# Altium project RT_v1.4.PrjPcb
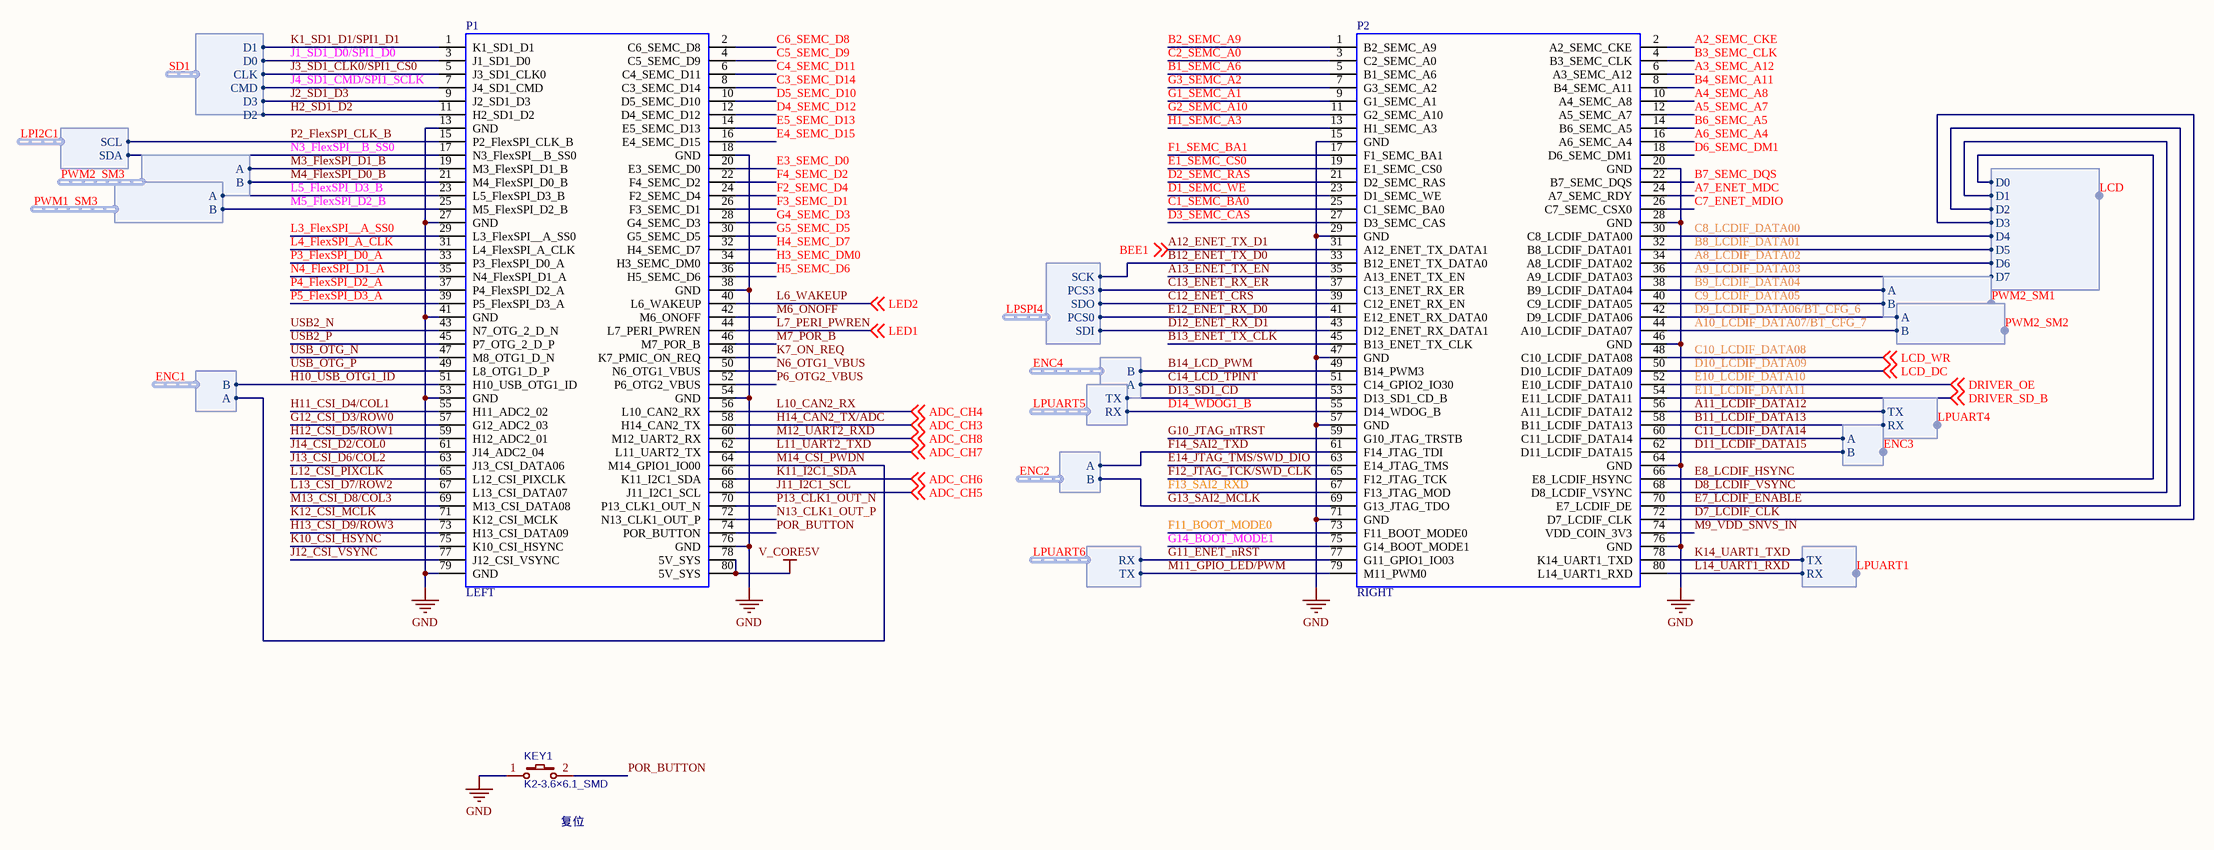
[diagram p0: COREv1.4.SchDoc]
6 sheets, 140 parts. Net scope: global (net labels, ports and power ports of the same name join across sheets).
Board file: RTv1.4.PcbDoc
Sheets:
  COREv1.4.SchDoc
  DCv1.4.SchDoc
  DRIVERv1.4.SchDoc
  CONNECTv1.4.SchDoc
  ANALOGv1.4.SchDoc
  CAMERAv1.4.SchDoc

## Sheet COREv1.4.SchDoc
size A2

### Parts
KEY1  K2-3.6×6.1_SMD  [KEY-SMD_2P-L6.2-W3.6-LS8.0]
P1  LEFT  [CON80]
P2  RIGHT  [CON80]

### Harnesses
I2C: SDA, SCL
data: D0, D1, D2, D3, D4, D5, D6, D7
PWM_SM: A, B
ENC: A, B
uart: TX, RX
SDHC: D1, D0, CLK, CMD, D3, D2
SPI: SDI, SDO, SCK, PCS0, PCS3

### Nets
GND: KEY1.1 P1.13(GND) P1.18(GND) P1.27(GND) P1.38(GND) P1.41(GND) P1.53(GND) P1.54(GND) P1.76(GND) P1.79(GND) P2.15(GND) P2.20(GND) P2.28(GND) P2.29(GND) P2.46(GND) P2.47(GND) P2.57(GND) P2.64(GND) P2.71(GND) P2.76(GND)
V_CORE5V: P1.78(5V_SYS) P1.80(5V_SYS)
A2_SEMC_CKE: P2.2(A2_SEMC_CKE)
A3_SEMC_A12: P2.6(A3_SEMC_A12)
A4_SEMC_A8: P2.10(A4_SEMC_A8)
A5_SEMC_A7: P2.12(A5_SEMC_A7)
A6_SEMC_A4: P2.16(A6_SEMC_A4)
A7_ENET_MDC: P2.24(A7_SEMC_RDY)
A8_LCDIF_DATA02: P2.34(A8_LCDIF_DATA02) ; harness data.D6
A9_LCDIF_DATA03: P2.36(A9_LCDIF_DATA03) ; harness data.D7
A10_LCDIF_DATA07/BT_CFG_7: P2.44(A10_LCDIF_DATA07) ; harness PWM_SM.B
A11_LCDIF_DATA12: P2.56(A11_LCDIF_DATA12) ; harness uart.TX
A12_ENET_TX_D1: P2.31(A12_ENET_TX_DATA1) ; off-sheet BEE1  [also labelled BEE1]
A13_ENET_TX_EN: P2.35(A13_ENET_TX_EN)
B1_SEMC_A6: P2.5(B1_SEMC_A6)
B2_SEMC_A9: P2.1(B2_SEMC_A9)
B3_SEMC_CLK: P2.4(B3_SEMC_CLK)
B4_SEMC_A11: P2.8(B4_SEMC_A11)
B6_SEMC_A5: P2.14(B6_SEMC_A5)
B7_SEMC_DQS: P2.22(B7_SEMC_DQS)
B8_LCDIF_DATA01: P2.32(B8_LCDIF_DATA01) ; harness data.D5
B9_LCDIF_DATA04: P2.38(B9_LCDIF_DATA04) ; harness PWM_SM.A
B11_LCDIF_DATA13: P2.58(B11_LCDIF_DATA13) ; harness uart.RX
B12_ENET_TX_D0: P2.33(B12_ENET_TX_DATA0) ; harness SPI.SCK
B13_ENET_TX_CLK: P2.45(B13_ENET_TX_CLK)
B14_LCD_PWM: P2.49(B14_PWM3) ; harness ENC.B
C1_SEMC_BA0: P2.25(C1_SEMC_BA0)
C2_SEMC_A0: P2.3(C2_SEMC_A0)
C3_SEMC_D14: P1.8(C3_SEMC_D14)
C4_SEMC_D11: P1.6(C4_SEMC_D11)
C5_SEMC_D9: P1.4(C5_SEMC_D9)
C6_SEMC_D8: P1.2(C6_SEMC_D8)
C7_ENET_MDIO: P2.26(C7_SEMC_CSX0)
C8_LCDIF_DATA00: P2.30(C8_LCDIF_DATA00) ; harness data.D4
C9_LCDIF_DATA05: P2.40(C9_LCDIF_DATA05) ; harness PWM_SM.B
C10_LCDIF_DATA08: P2.48(C10_LCDIF_DATA08) ; off-sheet LCD_WR  [also labelled LCD_WR]
C11_LCDIF_DATA14: P2.60(C11_LCDIF_DATA14) ; harness ENC.A
C12_ENET_CRS: P2.39(C12_ENET_RX_EN) ; harness SPI.SDO
C13_ENET_RX_ER: P2.37(C13_ENET_RX_ER) ; harness SPI.PCS3
C14_LCD_TPINT: P2.51(C14_GPIO2_IO30) ; harness ENC.A
D1_SEMC_WE: P2.23(D1_SEMC_WE)
D2_SEMC_RAS: P2.21(D2_SEMC_RAS)
D3_SEMC_CAS: P2.27(D3_SEMC_CAS)
D4_SEMC_D12: P1.12(D4_SEMC_D12)
D5_SEMC_D10: P1.10(D5_SEMC_D10)
D6_SEMC_DM1: P2.18(D6_SEMC_DM1)
D7_LCDIF_CLK: P2.72(D7_LCDIF_CLK) ; harness data.D3
D8_LCDIF_VSYNC: P2.68(D8_LCDIF_VSYNC) ; harness data.D1
D9_LCDIF_DATA06/BT_CFG_6: P2.42(D9_LCDIF_DATA06) ; harness PWM_SM.A
D10_LCDIF_DATA09: P2.50(D10_LCDIF_DATA09) ; off-sheet LCD_DC  [also labelled LCD_DC]
D11_LCDIF_DATA15: P2.62(D11_LCDIF_DATA15) ; harness ENC.B
D12_ENET_RX_D1: P2.43(D12_ENET_RX_DATA1) ; harness SPI.SDI
D13_SD1_CD: P2.53(D13_SD1_CD_B) ; harness uart.TX
D14_WDOG1_B: P2.55(D14_WDOG_B) ; harness uart.RX
E1_SEMC_CS0: P2.19(E1_SEMC_CS0)
E3_SEMC_D0: P1.20(E3_SEMC_D0)
E4_SEMC_D15: P1.16(E4_SEMC_D15)
E5_SEMC_D13: P1.14(E5_SEMC_D13)
E7_LCDIF_ENABLE: P2.70(E7_LCDIF_DE) ; harness data.D2
E8_LCDIF_HSYNC: P2.66(E8_LCDIF_HSYNC) ; harness data.D0
E10_LCDIF_DATA10: P2.52(E10_LCDIF_DATA10) ; off-sheet DRIVER_OE  [also labelled DRIVER_OE]
E11_LCDIF_DATA11: P2.54(E11_LCDIF_DATA11) ; off-sheet DRIVER_SD_B  [also labelled DRIVER_SD_B]
E12_ENET_RX_D0: P2.41(E12_ENET_RX_DATA0) ; harness SPI.PCS0
E14_JTAG_TMS/SWD_DIO: P2.63(E14_JTAG_TMS)
F1_SEMC_BA1: P2.17(F1_SEMC_BA1)
F2_SEMC_D4: P1.24(F2_SEMC_D4)
F3_SEMC_D1: P1.26(F3_SEMC_D1)
F4_SEMC_D2: P1.22(F4_SEMC_D2)
F11_BOOT_MODE0: P2.73(F11_BOOT_MODE0)
F12_JTAG_TCK/SWD_CLK: P2.65(F12_JTAG_TCK)
F13_SAI2_RXD: P2.67(F13_JTAG_MOD)
F14_SAI2_TXD: P2.61(F14_JTAG_TDI) ; harness ENC.A  [project net ENC2.A]
G1_SEMC_A1: P2.9(G1_SEMC_A1)
G2_SEMC_A10: P2.11(G2_SEMC_A10)
G3_SEMC_A2: P2.7(G3_SEMC_A2)
G4_SEMC_D3: P1.28(G4_SEMC_D3)
G5_SEMC_D5: P1.30(G5_SEMC_D5)
G10_JTAG_nTRST: P2.59(G10_JTAG_TRSTB)
G11_ENET_nRST: P2.77(G11_GPIO1_IO03) ; harness uart.RX
G12_CSI_D3/ROW0: P1.57(G12_ADC2_03)
G13_SAI2_MCLK: P2.69(G13_JTAG_TDO) ; harness ENC.B  [project net ENC2.B]
G14_BOOT_MODE1: P2.75(G14_BOOT_MODE1)
H1_SEMC_A3: P2.13(H1_SEMC_A3)
H2_SD1_D2: P1.11(H2_SD1_D2) ; harness SDHC.D2
H3_SEMC_DM0: P1.34(H3_SEMC_DM0)
H4_SEMC_D7: P1.32(H4_SEMC_D7)
H5_SEMC_D6: P1.36(H5_SEMC_D6)
H10_USB_OTG1_ID: P1.51(H10_USB_OTG1_ID) ; harness ENC.B  [project net ENC1.B]
H11_CSI_D4/COL1: P1.55(H11_ADC2_02)
H12_CSI_D5/ROW1: P1.59(H12_ADC2_01)
H13_CSI_D9/ROW3: P1.73(H13_CSI_DATA09)
H14_CAN2_TX/ADC: P1.58(H14_CAN2_TX) ; off-sheet ADC_CH3  [also labelled ADC_CH3]
J1_SD1_D0/SPI1_D0: P1.3(J1_SD1_D0) ; harness SDHC.D0
J2_SD1_D3: P1.9(J2_SD1_D3) ; harness SDHC.D3
J3_SD1_CLK0/SPI1_CS0: P1.5(J3_SD1_CLK0) ; harness SDHC.CLK
J4_SD1_CMD/SPI1_SCLK: P1.7(J4_SD1_CMD) ; harness SDHC.CMD
J11_I2C1_SCL: P1.68(J11_I2C1_SCL) ; off-sheet ADC_CH5  [also labelled ADC_CH5]
J12_CSI_VSYNC: P1.77(J12_CSI_VSYNC)
J13_CSI_D6/COL2: P1.63(J13_CSI_DATA06)
J14_CSI_D2/COL0: P1.61(J14_ADC2_04)
K1_SD1_D1/SPI1_D1: P1.1(K1_SD1_D1) ; harness SDHC.D1
K7_ON_REQ: P1.48(K7_PMIC_ON_REQ)
K10_CSI_HSYNC: P1.75(K10_CSI_HSYNC)
K11_I2C1_SDA: P1.66(K11_I2C1_SDA) ; off-sheet ADC_CH6  [also labelled ADC_CH6]
K12_CSI_MCLK: P1.71(K12_CSI_MCLK)
K14_UART1_TXD: P2.78(K14_UART1_TXD) ; harness uart.TX
L3_FlexSPI__A_SS0: P1.29(L3_FlexSPI__A_SS0)
L4_FlexSPI_A_CLK: P1.31(L4_FlexSPI_A_CLK)
L5_FlexSPI_D3_B: P1.23(L5_FlexSPI_D3_B) ; harness PWM_SM.A
L6_WAKEUP: P1.40(L6_WAKEUP) ; off-sheet LED2  [also labelled LED2]
L7_PERI_PWREN: P1.44(L7_PERI_PWREN) ; off-sheet LED1  [also labelled LED1]
L10_CAN2_RX: P1.56(L10_CAN2_RX) ; off-sheet ADC_CH4  [also labelled ADC_CH4]
L11_UART2_TXD: P1.62(L11_UART2_TX) ; off-sheet ADC_CH7  [also labelled ADC_CH7]
L12_CSI_PIXCLK: P1.65(L12_CSI_PIXCLK)
L13_CSI_D7/ROW2: P1.67(L13_CSI_DATA07)
L14_UART1_RXD: P2.80(L14_UART1_RXD) ; harness uart.RX
M3_FlexSPI_D1_B: P1.19(M3_FlexSPI_D1_B) ; harness PWM_SM.A
M4_FlexSPI_D0_B: P1.21(M4_FlexSPI_D0_B) ; harness PWM_SM.B
M5_FlexSPI_D2_B: P1.25(M5_FlexSPI_D2_B) ; harness PWM_SM.B
M6_ONOFF: P1.42(M6_ONOFF)
M7_POR_B: P1.46(M7_POR_B)
M9_VDD_SNVS_IN: P2.74(VDD_COIN_3V3)
M11_GPIO_LED/PWM: P2.79(M11_PWM0) ; harness uart.TX  [project net LPUART6.TX]
M12_UART2_RXD: P1.60(M12_UART2_RX) ; off-sheet ADC_CH8  [also labelled ADC_CH8]
M13_CSI_D8/COL3: P1.69(M13_CSI_DATA08)
M14_CSI_PWDN: P1.64(M14_GPIO1_IO00) ; harness ENC.A  [project net ENC1.A]
N3_FlexSPI__B_SS0: P1.17(N3_FlexSPI__B_SS0) ; harness I2C.SDA  [project net LPI2C1.SDA]
N4_FlexSPI_D1_A: P1.35(N4_FlexSPI_D1_A)
N6_OTG1_VBUS: P1.50(N6_OTG1_VBUS)
N13_CLK1_OUT_P: P1.72(N13_CLK1_OUT_P)
P2_FlexSPI_CLK_B: P1.15(P2_FlexSPI_CLK_B) ; harness I2C.SCL  [project net LPI2C1.SCL]
P3_FlexSPI_D0_A: P1.33(P3_FlexSPI_D0_A)
P4_FlexSPI_D2_A: P1.37(P4_FlexSPI_D2_A)
P5_FlexSPI_D3_A: P1.39(P5_FlexSPI_D3_A)
P6_OTG2_VBUS: P1.52(P6_OTG2_VBUS)
P13_CLK1_OUT_N: P1.70(P13_CLK1_OUT_N)
POR_BUTTON: KEY1.2 P1.74(POR_BUTTON)
USB2_N: P1.43(N7_OTG_2_D_N)
USB2_P: P1.45(P7_OTG_2_D_P)
USB_OTG_N: P1.47(M8_OTG1_D_N)
USB_OTG_P: P1.49(L8_OTG1_D_P)

### Notes on the sheet
- (near KEY1) 复位

### Library data of the parts
KEY1 = K2-3.6×6.1_SMD: BOM_Manufacturer Part: K2-1107ST-A4SW-06; Contributor: LCEDA_Lib; 制造商: 韩国韩荣; BOM_Supplier Part: C118141; BOM_Supplier: LCSC; spicePre: K; spiceSymbolName: K2-3.6×6.1_SMD
P1 = Header40X2_left: Header, 30-Pin, Dual row; LatestRevisionDate: 17-Jul-2002; LatestRevisionNote: Re-released for DXP Platform.; Publisher: Altium Limited
P2 = Header40X2_right: Header, 30-Pin, Dual row; LatestRevisionDate: 17-Jul-2002; LatestRevisionNote: Re-released for DXP Platform.; Publisher: Altium Limited

## Sheet DCv1.4.SchDoc
size A4
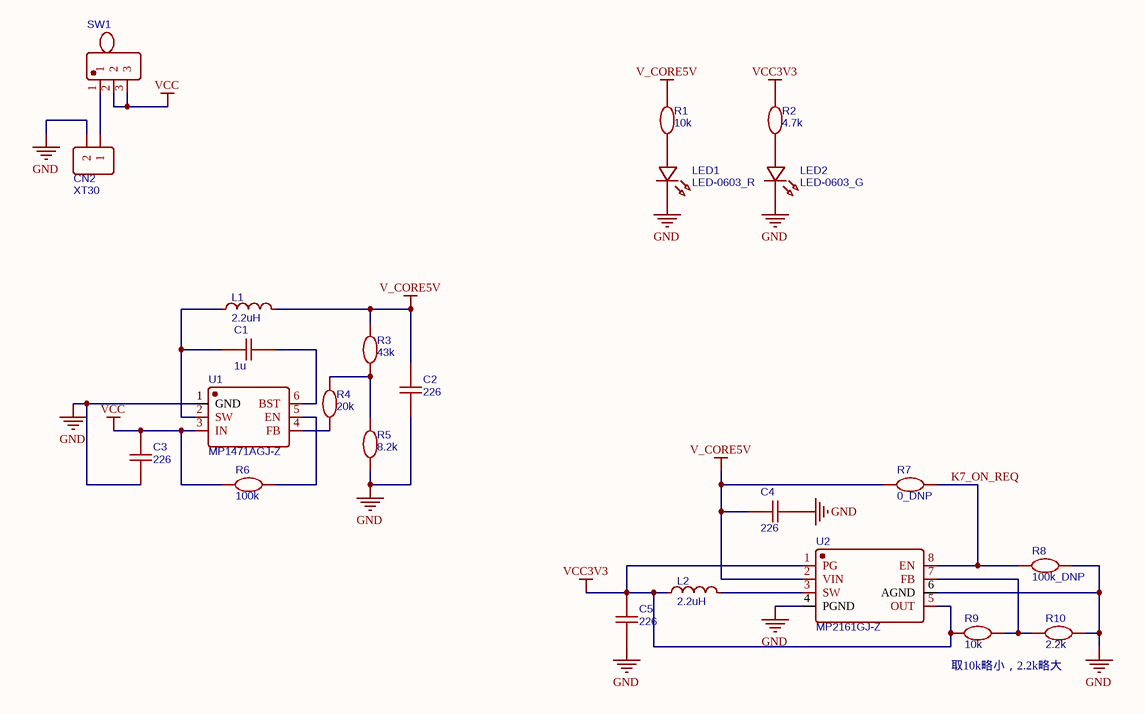
[diagram p1: DCv1.4.SchDoc]

### Parts
C1  1u  [C0603]
C2  226  [C0603]
C3  226  [C0603]
C4  226  [C0603]
C5  226  [C0603]
CN2  XT30  [CONN-TH_XT30UPB-F]
L1  2.2uH  [IND-SMD_L4.4-W4.2]
L2  2.2uH  [IND-SMD_L4.4-W4.2]
LED1  LED-0603_R  [LED0603_RED]
LED2  LED-0603_G  [LED0603_GREEN]
R1  10k  [R0603]
R2  4.7k  [R0603]
R3  43k  [R0603]
R4  20k  [R0603]
R5  8.2k  [R0603]
R6  100k  [R0603]
R7  0_DNP  [R0603]
R8  100k_DNP  [R0603]
R9  10k  [R0603]
R10  2.2k  [R0603]
SW1  2MS1T1B1M1QES-5  [SW-TH_2MD1T1B1M1QES-5]  (value not drawn)
U1  MP1471AGJ-Z  [TSOT-23-6_L2.9-W1.6-P0.95-LS2.8-BR]
U2  MP2161GJ-Z  [TSOT-23-8_L2.9-W1.6-P0.65-LS2.8-BR]

### Nets
GND: C2.1 C3.1 C4.1 C5.1 CN2.2 LED1.2 LED2.2 R5.1 R8.2 R10.2 U1.1(GND) U2.4(PGND) U2.6(AGND)
V_CORE5V: C2.2 C4.2 L1.2 R1.2 R3.2 R7.1 U2.2(VIN)
VCC: C3.2 R6.2 SW1.2 SW1.3 U1.3(IN)
VCC3V3: C5.2 L2.1 R2.2 R9.1 U2.1(PG) U2.5(OUT)
K7_ON_REQ: R7.2 R8.1 U2.8(EN)
NetC1_1: C1.1 L1.1 U1.2(SW)
NetC1_2: C1.2 U1.6(BST)
NetCN2_1: CN2.1 SW1.1
NetL2_2: L2.2 U2.3(SW)
NetLED1_1: LED1.1 R1.1
NetLED2_1: LED2.1 R2.1
NetR3_1: R3.1 R4.2 R5.2
NetR4_1: R4.1 U1.4(FB)
NetR6_1: R6.1 U1.5(EN)
NetR9_2: R9.2 R10.1 U2.7(FB)

### Notes on the sheet
- 取10k略小，2.2k略大

### Library data of the parts
C1-C5 = C0603: nameAlias: Value(F); Contributor: LCEDA_Lib; spicePre: C; spiceSymbolName: C_0603_US
CN2 = XT30: BOM_Manufacturer: Changzhou Amass Elec; BOM_Manufacturer Part: XT30UPB-F; nameAlias: Value; Contributor: LCSC; BOM_Supplier: LCSC; BOM_Supplier Part: C108769; spicePre: C; spiceSymbolName: XT30UPB-F
L1 L2 = L0420: BOM_Manufacturer: Changjiang Microelectronics Tech; BOM_Manufacturer Part: FXL0420-2R2-M; nameAlias: Inductance; Contributor: LCSC; BOM_Supplier: LCSC; BOM_Supplier Part: C167206; spicePre: L; spiceSymbolName: FXL0420-2R2-M
LED1 = LED-0603_R: BOM_Manufacturer: EVERLIGHT(台湾亿光); BOM_Manufacturer Part: 19-217/R6C-AL1M2VY/3T; Contributor: LCEDA_01; BOM_Supplier Part: C72044; BOM_Supplier: LCSC; spicePre: L; spiceSymbolName: LED-0603_R
LED2 = LED-0603_G: BOM_Manufacturer: EVERLIGHT(台湾亿光); BOM_Manufacturer Part: 19-217/GHC-YR1S2/3T; Contributor: LCEDA_Lib; BOM_Supplier Part: C72043; BOM_Supplier: LCSC; spicePre: L; spiceSymbolName: LED-0603_G
R1-R10 = R0603: nameAlias: Value(Ω); Contributor: LCEDA_Lib; spicePre: R; spiceSymbolName: R_0603_EU
SW1 = 2MS1T1B1M1QES-5: BOM_Manufacturer: Dailywell; Contributor: LCSC; BOM_Supplier: LCSC; BOM_Supplier Part: C496169; BOM_Manufacturer Part: 2MS1T1B1M1QES-5; spicePre: S; spiceSymbolName: 2MS1T1B1M1QES-5
U1 = MP1471AGJ-Z: BOM_Manufacturer: MPS; SMT Type: Extend; BOM_Supplier: LCSC; BOM_Manufacturer Part: MP1471AGJ-Z; image: //image.lceda.cn/szlcsc/C58565.jpg; BOM_Supplier Part: C58565; BOM_LCSC Assembly: Yes; spicePre: U; spiceSymbolName: MP1471AGJ-Z
U2 = MP2161GJ-Z: BOM_Manufacturer: MPS; SMT Type: Extend; BOM_Supplier: LCSC; BOM_Manufacturer Part: MP2161GJ-Z; image: //image.lceda.cn/szlcsc/C84831.jpg; BOM_Supplier Part: C84831; BOM_LCSC Assembly: Yes; spicePre: U; spiceSymbolName: MP2161GJ-Z

## Sheet DRIVERv1.4.SchDoc
size A4
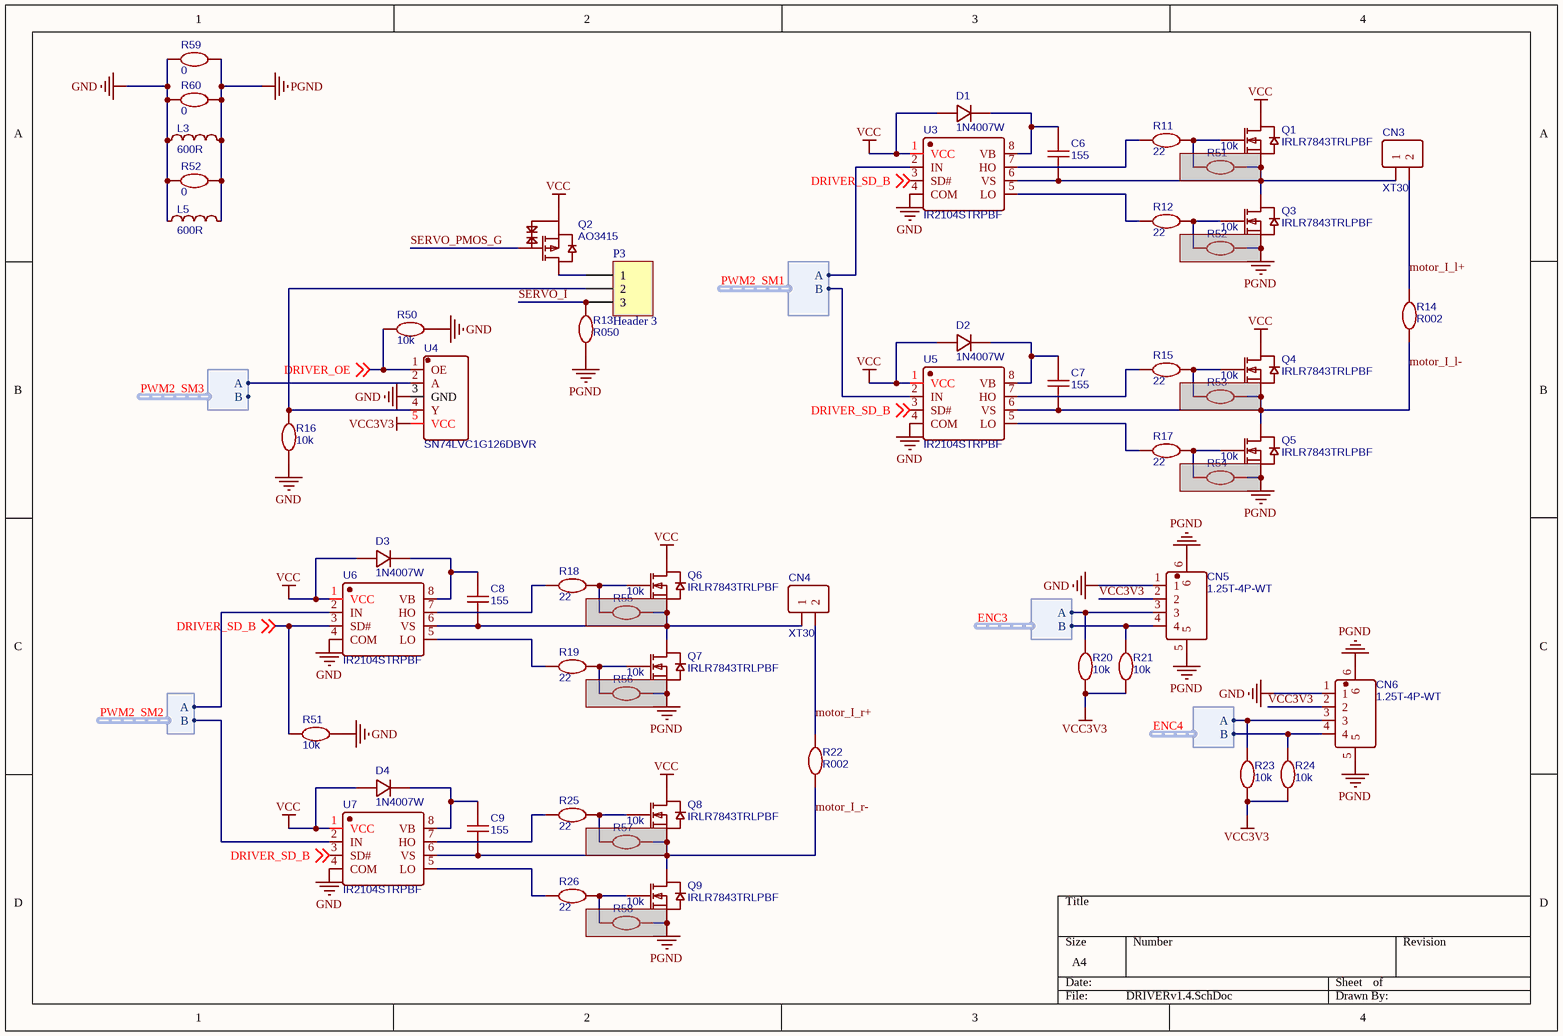
[diagram p2: DRIVERv1.4.SchDoc]

### Parts
(Parts that share a designator on the sheet are numbered #1, #2 ... from top to bottom, then left to right.)
C6  155  [C0603]
C7  155  [C0603]
C8  155  [C0603]
C9  155  [C0603]
CN3  XT30  [CONN-TH_XT30UPB-F]
CN4  XT30  [CONN-TH_XT30UPB-F]
CN5  1.25T-4P-WT  [CONN-SMD_4P-1.25P_1.25T-4P]
CN6  1.25T-4P-WT  [CONN-SMD_4P-1.25P_1.25T-4P]
D1  1N4007W  [SOD-123_L2.8-W1.8-LS3.7-RD]
D2  1N4007W  [SOD-123_L2.8-W1.8-LS3.7-RD]
D3  1N4007W  [SOD-123_L2.8-W1.8-LS3.7-RD]
D4  1N4007W  [SOD-123_L2.8-W1.8-LS3.7-RD]
L3  600R  [L0603]
L5  600R  [L0603]
P3  Header 3  [HDR1X3]
Q1  IRLR7843TRLPBF  [DPAK_L6.5-W6.0-P2.29-LS9.9-TL]
Q2  AO3415  [SOT-23-3_L2.9-W1.3-P1.90-LS2.4-BR]
Q3  IRLR7843TRLPBF  [DPAK_L6.5-W6.0-P2.29-LS9.9-TL]
Q4  IRLR7843TRLPBF  [DPAK_L6.5-W6.0-P2.29-LS9.9-TL]
Q5  IRLR7843TRLPBF  [DPAK_L6.5-W6.0-P2.29-LS9.9-TL]
Q6  IRLR7843TRLPBF  [DPAK_L6.5-W6.0-P2.29-LS9.9-TL]
Q7  IRLR7843TRLPBF  [DPAK_L6.5-W6.0-P2.29-LS9.9-TL]
Q8  IRLR7843TRLPBF  [DPAK_L6.5-W6.0-P2.29-LS9.9-TL]
Q9  IRLR7843TRLPBF  [DPAK_L6.5-W6.0-P2.29-LS9.9-TL]
R11  22  [R0603]
R12  22  [R0603]
R13  R050  [R2010]
R14  R002  [R2010]
R15  22  [R0603]
R16  10k  [R0603]
R17  22  [R0603]
R18  22  [R0603]
R19  22  [R0603]
R20  10k  [R0603]
R21  10k  [R0603]
R22  R002  [R2010]
R23  10k  [R0603]
R24  10k  [R0603]
R25  22  [R0603]
R26  22  [R0603]
R50#1  10k  [R0603]
R51#1  10k  [R0603]  (masked out: inside a compile mask, not in the netlist)
R51#2  10k  [R0603]
R52#1  0  [R0603]
R52#2  10k  [R0603]  (masked out: inside a compile mask, not in the netlist)
R53  10k  [R0603]  (masked out: inside a compile mask, not in the netlist)
R54  10k  [R0603]  (masked out: inside a compile mask, not in the netlist)
R55  10k  [R0603]  (masked out: inside a compile mask, not in the netlist)
R56  10k  [R0603]  (masked out: inside a compile mask, not in the netlist)
R57  10k  [R0603]  (masked out: inside a compile mask, not in the netlist)
R58  10k  [R0603]  (masked out: inside a compile mask, not in the netlist)
R59  0  [R0603]
R60  0  [R0603]
U3  IR2104STRPBF  [SOIC-8_L4.9-W3.9-P1.27-LS6.0-BL]
U4  SN74LVC1G126DBVR  [SOT-23-5_L3.0-W1.7-P0.95-LS2.8-BR]
U5  IR2104STRPBF  [SOIC-8_L4.9-W3.9-P1.27-LS6.0-BL]
U6  IR2104STRPBF  [SOIC-8_L4.9-W3.9-P1.27-LS6.0-BL]
U7  IR2104STRPBF  [SOIC-8_L4.9-W3.9-P1.27-LS6.0-BL]

### Harnesses
ENC: A, B
PWM_SM: A, B

### Nets
GND: CN5.1 CN6.1 L3.1 L5.1 R16.1 R50#1.1 R51#2.1 R52#1.1 R59.1 R60.1 U3.4(COM) U4.3(GND) U5.4(COM) U6.4(COM) U7.4(COM)
PGND: CN5.5 CN5.6 CN6.5 CN6.6 L3.2 L5.2 R13.1 R52#1.2 R59.2 R60.2
VCC: D1.2 D2.2 D3.2 D4.2 Q1.4(D) Q2.2(S) Q4.4(D) Q6.4(D) Q8.4(D) U3.1(VCC) U5.1(VCC) U6.1(VCC) U7.1(VCC)
VCC3V3: CN5.2 CN6.2 R20.1 R21.1 R23.1 R24.1 U4.5(VCC)
A10_LCDIF_DATA07/BT_CFG_7: U7.2(IN) ; harness PWM_SM.B
B9_LCDIF_DATA04: U3.2(IN) ; harness PWM_SM.A
B14_LCD_PWM: CN6.4 R24.2 ; harness ENC.B
C9_LCDIF_DATA05: U5.2(IN) ; harness PWM_SM.B
C11_LCDIF_DATA14: CN5.3 R20.2 ; harness ENC.A
C14_LCD_TPINT: CN6.3 R23.2 ; harness ENC.A
D9_LCDIF_DATA06/BT_CFG_6: U6.2(IN) ; harness PWM_SM.A
D11_LCDIF_DATA15: CN5.4 R21.2 ; harness ENC.B
DRIVER_OE: R50#1.2 U4.1(OE) ; off-sheet DRIVER_OE  [project net E10_LCDIF_DATA10]
DRIVER_SD_B: R51#2.2 U3.3(SD#) U5.3(SD#) U6.3(SD#) U7.3(SD#) ; off-sheet DRIVER_SD_B  [project net E11_LCDIF_DATA11]
M3_FlexSPI_D1_B: U4.2(A) ; harness PWM_SM.A
motor_I_l+: CN3.2 R14.2
motor_I_l-: C7.1 Q4.3(S) Q5.4(D) R14.1 U5.6(VS)
motor_I_r+: CN4.2 R22.2
motor_I_r-: C9.1 Q8.3(S) Q9.4(D) R22.1 U7.6(VS)
SERVO_I: P3.3 R13.2
SERVO_PMOS_G: Q2.1(G)
NetC6_1: C6.1 CN3.1 Q1.3(S) Q3.4(D) U3.6(VS)
NetC6_2: C6.2 D1.1 U3.8(VB)
NetC7_2: C7.2 D2.1 U5.8(VB)
NetC8_1: C8.1 CN4.1 Q6.3(S) Q7.4(D) U6.6(VS)
NetC8_2: C8.2 D3.1 U6.8(VB)
NetC9_2: C9.2 D4.1 U7.8(VB)
NetP3_1: P3.1 Q2.3(D)
NetP3_2: P3.2 R16.2 U4.4(Y)
NetQ1_1: Q1.1(G) R11.2
NetQ3_1: Q3.1(G) R12.2
NetQ4_1: Q4.1(G) R15.2
NetQ5_1: Q5.1(G) R17.2
NetQ6_1: Q6.1(G) R18.2
NetQ7_1: Q7.1(G) R19.2
NetQ8_1: Q8.1(G) R25.2
NetQ9_1: Q9.1(G) R26.2
NetR11_1: R11.1 U3.7(HO)
NetR12_1: R12.1 U3.5(LO)
NetR15_1: R15.1 U5.7(HO)
NetR17_1: R17.1 U5.5(LO)
NetR18_1: R18.1 U6.7(HO)
NetR19_1: R19.1 U6.5(LO)
NetR25_1: R25.1 U7.7(HO)
NetR26_1: R26.1 U7.5(LO)

Not connected (* = marked no-connect by the designer): Q3 3(S); Q5 3(S); Q7 3(S); Q9 3(S)

### Library data of the parts
C6-C9 = C0603: as C1 on sheet DCv1.4; spicePre: C; spiceSymbolName: C_0603_US
CN3 CN4 = XT30: as CN2 on sheet DCv1.4; BOM_Supplier: LCSC; BOM_Supplier Part: C108769; spicePre: C; spiceSymbolName: XT30UPB-F
CN5 CN6 = 1.25T-4P-WT: BOM_Manufacturer: HRO; Contributor: LCSC; BOM_Supplier: LCSC; BOM_Manufacturer Part: 1.25T-4P-WT; BOM_Supplier Part: C125739; spicePre: C; spiceSymbolName: 1.25T-4P-WT
D1-D4 = 1N4007W: BOM_Manufacturer: BLUE ROCKET; Contributor: LCEDA_Lib; BOM_Supplier: LCSC; BOM_Supplier Part: C328592; BOM_Manufacturer Part: 1N4007W; spicePre: D; spiceSymbolName: 1N4007W
L3 L5 = L0603: nameAlias: Value(H); Contributor: LCEDA_Lib; spicePre: L; spiceSymbolName: L0603_US
P3 = Header 3: Header, 3-Pin; LatestRevisionDate: 17-Jul-2002; LatestRevisionNote: Re-released for DXP Platform.; Publisher: Altium Limited
Q1 Q3-Q9 = IRLR7843TRLPBF: BOM_Manufacturer: Infineon Technologies; Contributor: LCSC; BOM_Supplier: LCSC; BOM_Supplier Part: C538178; BOM_Manufacturer Part: IRLR7843TRLPBF; spicePre: Q; spiceSymbolName: IRLR7843TRLPBF
Q2 = AO3415: BOM_Manufacturer: AOS; SMT Type: Extend; BOM_Supplier: LCSC; BOM_Manufacturer Part: AO3415; image: //image.lceda.cn/szlcsc/C14354.jpg; BOM_Supplier Part: C14354; BOM_LCSC Assembly: Yes; spicePre: Q; spiceSymbolName: AO3415
R11 R12 R15-R21 R23-R26 R50#1 R51#1 R51#2 R52#1 R52#2 R53-R60 = R0603: as R1 on sheet DCv1.4; spicePre: R; spiceSymbolName: R_0603_EU
R13 R14 R22 = R2010: nameAlias: Value(Ω); Contributor: LCEDA_Lib; spicePre: R; spiceSymbolName: R_2010_EU
U3 U5-U7 = IR2104STRPBF: BOM_Manufacturer: IR; SMT Type: Extend; spicePre: X; BOM_Supplier: LCSC; BOM_Manufacturer Part: IR2104STRPBF; image: //image.lceda.cn/szlcsc/C2960.jpg; BOM_Supplier Part: C2960; BOM_LCSC Assembly: Yes; spiceSymbolName: IR2104STRPBF
U4 = SN74LVC1G126DBVR: BOM_Manufacturer: TI; SMT Type: Extend; BOM_Supplier: LCSC; BOM_Manufacturer Part: SN74LVC1G126DBVR; image: //image.lceda.cn/szlcsc/C7834.jpg; BOM_Supplier Part: C7834; BOM_LCSC Assembly: Yes; spicePre: U; spiceSymbolName: SN74LVC1G126DBVR

## Sheet CONNECTv1.4.SchDoc
size A3
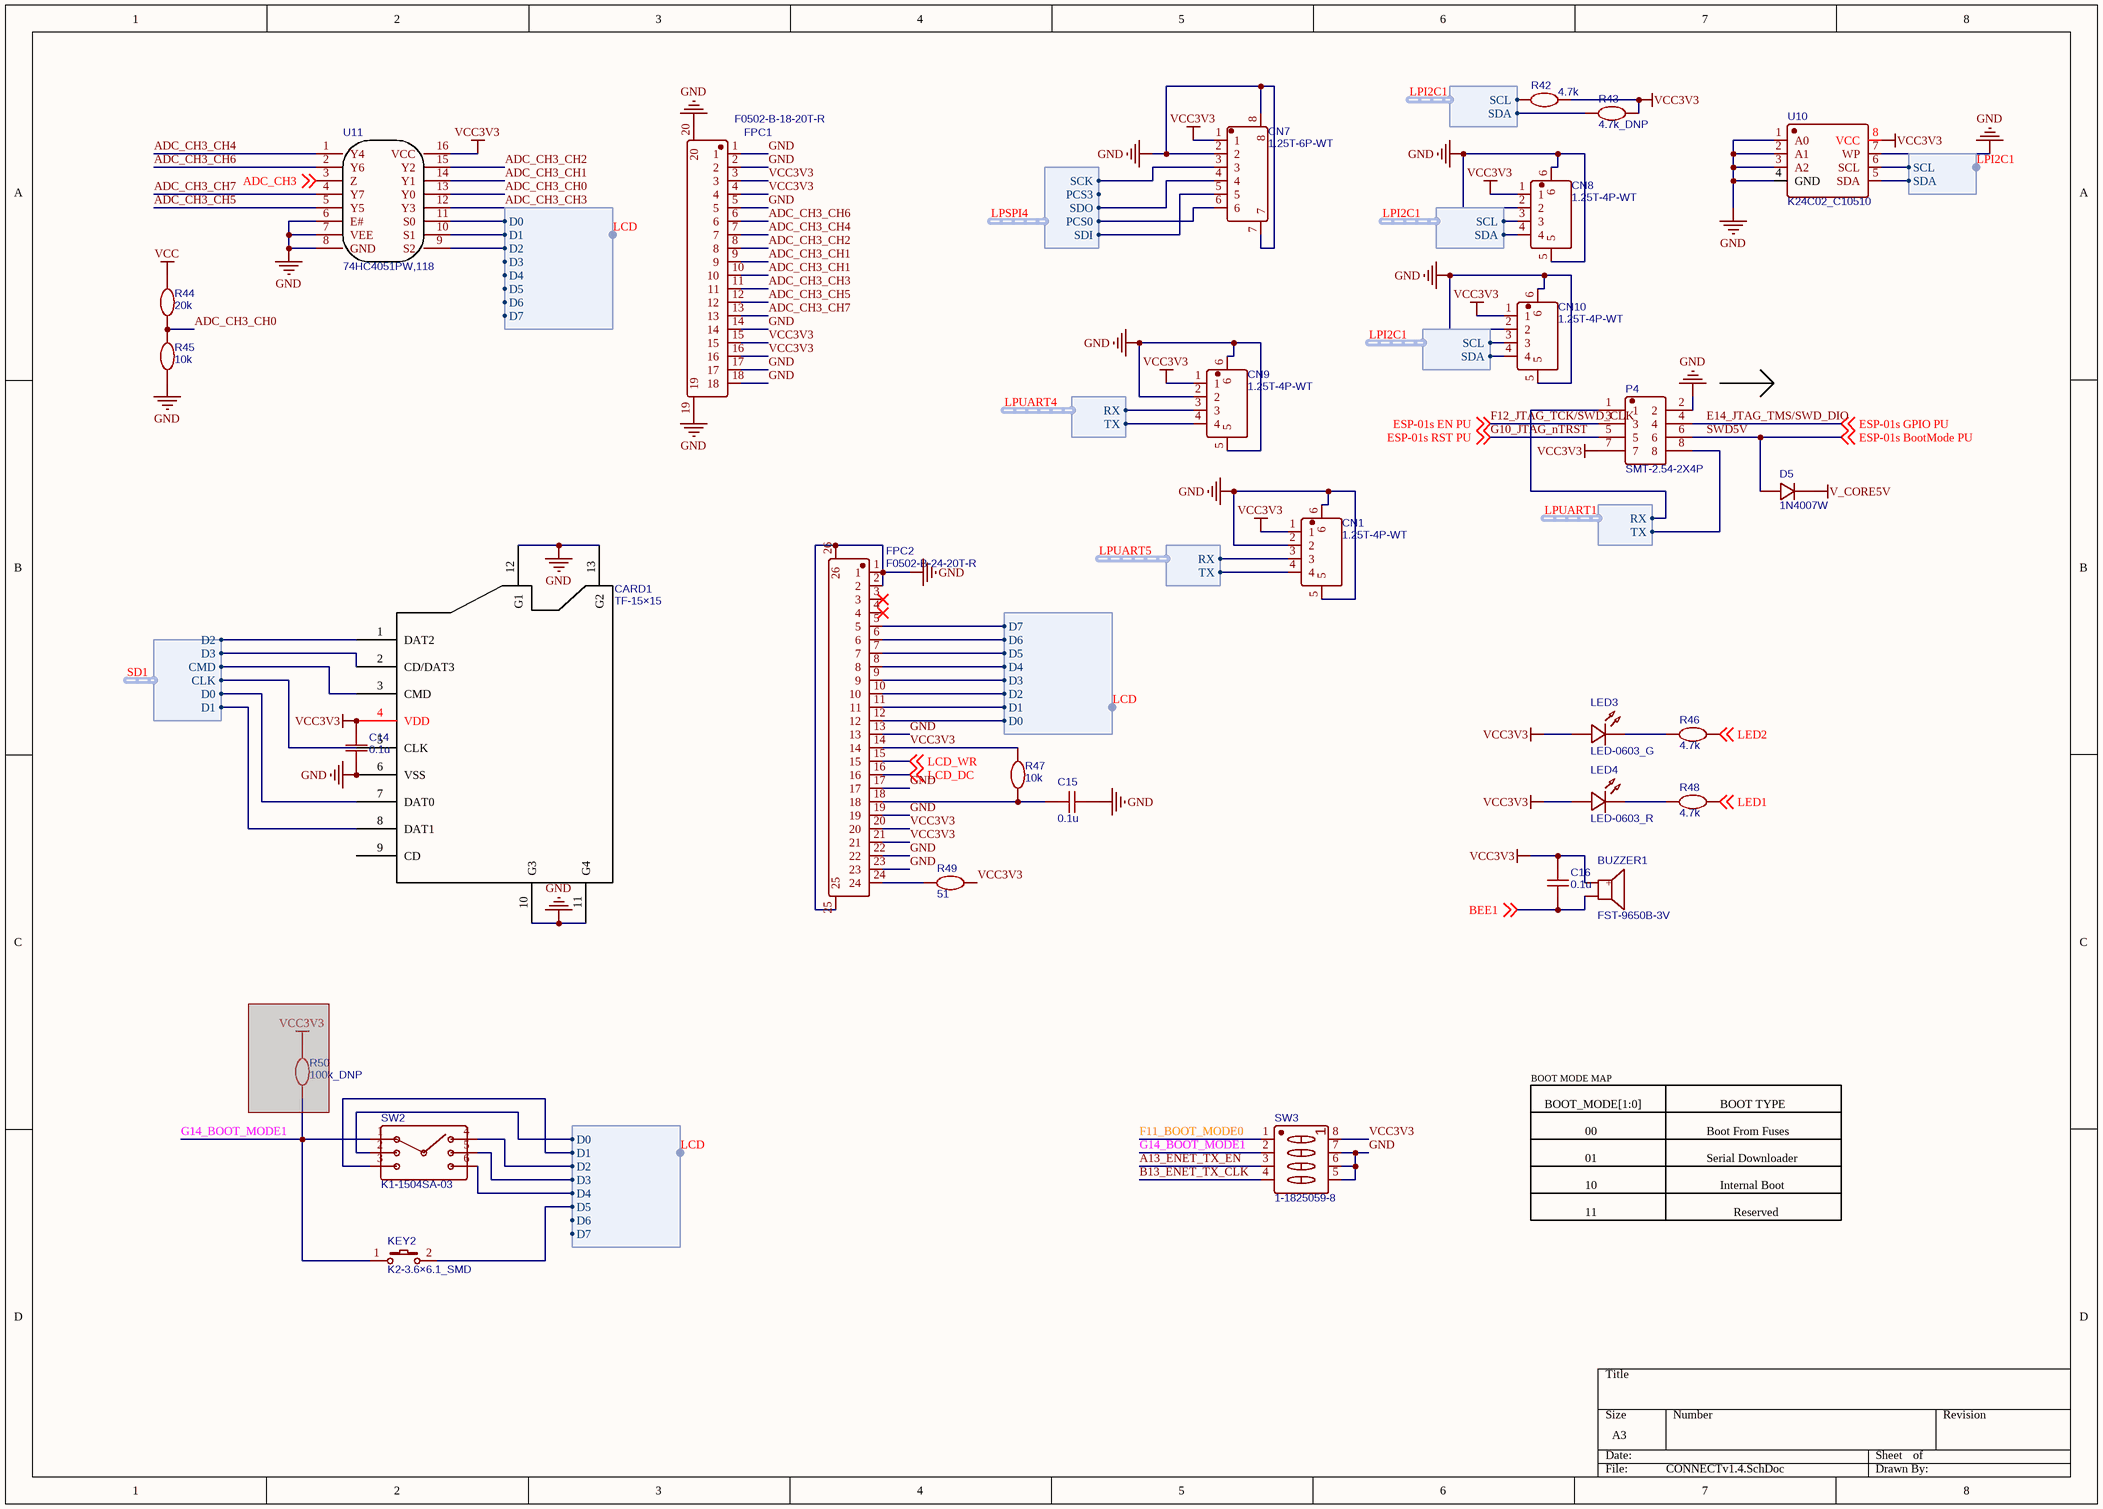
[diagram p3: CONNECTv1.4.SchDoc]

### Parts
(Parts that share a designator on the sheet are numbered #1, #2 ... from top to bottom, then left to right.)
BUZZER1  FST-9650B-3V  [BUZ-SMD_L9.6-W9.6-LS10.0-R]
C14  0.1u  [C0603]
C15  0.1u  [C0603]
C16  0.1u  [C0603]
CARD1  TF-15×15  [PCBComponent_1 - duplicate]
CN1  1.25T-4P-WT  [CONN-SMD_4P-1.25P_1.25T-4P]
CN7  1.25T-6P-WT  [CONN-SMD_6P-P1.25_1.25T-6P-WT]
CN8  1.25T-4P-WT  [CONN-SMD_4P-1.25P_1.25T-4P]
CN9  1.25T-4P-WT  [CONN-SMD_4P-1.25P_1.25T-4P]
CN10  1.25T-4P-WT  [CONN-SMD_4P-1.25P_1.25T-4P]
D5  1N4007W  [SOD-123_L2.8-W1.8-LS3.7-RD]
FPC1  F0502-B-18-20T-R  [FPC-SMD_18P-P0.50_F0502-B-18-20T-R]
FPC2  F0502-B-24-20T-R  [FPC-SMD_24P-P0.50_F0502-B-24-20T-R]
KEY2  K2-3.6×6.1_SMD  [KEY-SMD_2P-L6.2-W3.6-LS8.0]
LED3  LED-0603_G  [LED0603_GREEN]
LED4  LED-0603_R  [LED0603_RED]
P4  SMT-2.54-2X4P  [SMT-2.54-2X4P]
R42  4.7k  [R0603]
R43  4.7k_DNP  [R0603]
R44  20k  [R0603]
R45  10k  [R0603]
R46  4.7k  [R0603]
R47  10k  [R0603]
R48  4.7k  [R0603]
R49  51  [R0603]
R50#2  100k_DNP  [R0603]  (masked out: inside a compile mask, not in the netlist)
SW2  K1-1504SA-03  [SW-TH_K1-1504SA-03]
SW3  1-1825059-8  [SW-TH_1-1825059-8]
U10  K24C02_C10510  [SOIC-8_L4.9-W3.9-P1.27-LS6.0-BL]
U11  74HC4051PW,118  [TSSOP-16_L5.0-W4.4-P0.65-LS6.4-BL]

### Harnesses
data: D0, D1, D2, D3, D4, D5, D6, D7
SDHC: D1, D0, CLK, CMD, D3, D2
SPI: SDI, SDO, SCK, PCS0, PCS3
I2C: SDA, SCL
uart: TX, RX

### Nets
GND: C14.1 C15.1 CARD1.6(VSS) CARD1.10(G3) CARD1.11(G4) CARD1.12(G1) CARD1.13(G2) CN1.2 CN1.5 CN1.6 CN7.2 CN7.7 CN7.8 CN8.2 CN8.5 CN8.6 CN9.2 CN9.5 CN9.6 CN10.2 CN10.5 CN10.6 FPC1.1 FPC1.2 FPC1.5 FPC1.14 FPC1.17 FPC1.18 FPC1.19 FPC1.20 FPC2.1 FPC2.2 FPC2.13 FPC2.17 FPC2.19 FPC2.22 FPC2.23 FPC2.25 FPC2.26 P4.2 R45.1 SW3.5(PIN5) SW3.6(PIN6) SW3.7(PIN7) U10.1(A0) U10.2(A1) U10.3(A2) U10.4(GND) U10.7(WP) U11.6(E#) U11.7(VEE) U11.8(GND)
V_CORE5V: D5.1
VCC: R44.2
VCC3V3: BUZZER1.1(+) C14.2 C16.2 CARD1.4(VDD) CN1.1 CN7.1 CN8.1 CN9.1 CN10.1 FPC1.3 FPC1.4 FPC1.15 FPC1.16 FPC2.14 FPC2.20 FPC2.21 LED3.1 LED4.1 P4.7 R42.2 R43.2 R47.2 R49.1 SW3.8(PIN8) U10.8(VCC) U11.16(VCC)
A8_LCDIF_DATA02: FPC2.6 ; harness data.D6
A9_LCDIF_DATA03: FPC2.5 ; harness data.D7
A11_LCDIF_DATA12: CN9.4 ; harness uart.TX
A13_ENET_TX_EN: SW3.3(PIN3)
ADC_CH3: U11.3(Z) ; off-sheet ADC_CH3  [project net H14_CAN2_TX/ADC]
ADC_CH3_CH0: R44.1 R45.2 U11.13(Y0)
ADC_CH3_CH1: FPC1.9 FPC1.10 U11.14(Y1)
ADC_CH3_CH2: FPC1.8 U11.15(Y2)
ADC_CH3_CH3: FPC1.11 U11.12(Y3)
ADC_CH3_CH4: FPC1.7 U11.1(Y4)
ADC_CH3_CH5: FPC1.12 U11.5(Y5)
ADC_CH3_CH6: FPC1.6 U11.2(Y6)
ADC_CH3_CH7: FPC1.13 U11.4(Y7)
B8_LCDIF_DATA01: FPC2.7 KEY2.2 ; harness data.D5
B11_LCDIF_DATA13: CN9.3 ; harness uart.RX
B12_ENET_TX_D0: CN7.3 ; harness SPI.SCK
B13_ENET_TX_CLK: SW3.4(PIN4)
BEE1: BUZZER1.2 C16.1 ; off-sheet BEE1  [project net A12_ENET_TX_D1]
C8_LCDIF_DATA00: FPC2.8 SW2.6(COMMON) ; harness data.D4
C12_ENET_CRS: CN7.4 ; harness SPI.SDO
D7_LCDIF_CLK: FPC2.9 SW2.5(D) ; harness data.D3
D8_LCDIF_VSYNC: FPC2.11 SW2.3(C) U11.10(S1) ; harness data.D1
D12_ENET_RX_D1: CN7.5 ; harness SPI.SDI
D13_SD1_CD: CN1.4 ; harness uart.TX
D14_WDOG1_B: CN1.3 ; harness uart.RX
E7_LCDIF_ENABLE: FPC2.10 SW2.4(CENTER) U11.9(S2) ; harness data.D2
E8_LCDIF_HSYNC: FPC2.12 SW2.2(B) U11.11(S0) ; harness data.D0
E12_ENET_RX_D0: CN7.6 ; harness SPI.PCS0
E14_JTAG_TMS/SWD_DIO: P4.4 ; off-sheet ESP-01s GPIO PU  [also labelled ESP-01s GPIO PU]
F11_BOOT_MODE0: SW3.1(PIN1)
F12_JTAG_TCK/SWD_CLK: P4.3 ; off-sheet ESP-01s EN PU  [also labelled ESP-01s EN PU]
G10_JTAG_nTRST: P4.5 ; off-sheet ESP-01s RST PU  [also labelled ESP-01s RST PU]
G14_BOOT_MODE1: KEY2.1 SW2.1(A) SW3.2(PIN2)
H2_SD1_D2: CARD1.1(DAT2) ; harness SDHC.D2
J1_SD1_D0/SPI1_D0: CARD1.7(DAT0) ; harness SDHC.D0
J2_SD1_D3: CARD1.2(CD/DAT3) ; harness SDHC.D3
J3_SD1_CLK0/SPI1_CS0: CARD1.5(CLK) ; harness SDHC.CLK
J4_SD1_CMD/SPI1_SCLK: CARD1.3(CMD) ; harness SDHC.CMD
K1_SD1_D1/SPI1_D1: CARD1.8(DAT1) ; harness SDHC.D1
K14_UART1_TXD: P4.8 ; harness uart.TX
L14_UART1_RXD: P4.1 ; harness uart.RX
LCD_DC: FPC2.16 ; off-sheet LCD_DC  [project net D10_LCDIF_DATA09]
LCD_WR: FPC2.15 ; off-sheet LCD_WR  [project net C10_LCDIF_DATA08]
LED1: R48.2 ; off-sheet LED1  [project net L7_PERI_PWREN]
LED2: R46.2 ; off-sheet LED2  [project net L6_WAKEUP]
LPI2C1.SCL: CN8.3 CN10.3 R42.1 U10.6(SCL) ; harness I2C.SCL
LPI2C1.SDA: CN8.4 CN10.4 R43.1 U10.5(SDA) ; harness I2C.SDA
SWD5V: D5.2 P4.6 ; off-sheet ESP-01s BootMode PU  [also labelled ESP-01s BootMode PU]
NetC15_2: C15.2 FPC2.18 R47.1
NetFPC2_24: FPC2.24 R49.2
NetLED3_2: LED3.2 R46.1
NetLED4_2: LED4.2 R48.1

Not connected (* = marked no-connect by the designer): CARD1 9(CD); FPC2 3* 4*

### Notes on the sheet
- BOOT MODE MAP
- BOOT_MODE[1:0]
- BOOT TYPE
- 00
- 01
- 10
- Boot From Fuses
- Serial Downloader
- Internal Boot
- 11
- Reserved

### Library data of the parts
BUZZER1 = FST-9650B-3V: BOM_Manufacturer: FUET; Contributor: LCSC; BOM_Supplier: LCSC; BOM_Supplier Part: C391032; BOM_Manufacturer Part: FST-9650B-3V; spicePre: B; spiceSymbolName: FST-9650B-3V
C14-C16 = C0603: as C1 on sheet DCv1.4; spicePre: C; spiceSymbolName: C_0603_US
CARD1 = TF-15×15: BOM_Manufacturer: SOFNG; BOM_Supplier: LCSC; BOM_Manufacturer Part: TF-15×15; BOM_Supplier Part: C111196; spicePre: C; spiceSymbolName: TF-15×15
CN1 CN8-CN10 = 1.25T-4P-WT: BOM_Manufacturer: HRO; Contributor: LCSC; BOM_Supplier: LCSC; BOM_Manufacturer Part: 1.25T-4P-WT; BOM_Supplier Part: C125739; spicePre: C; spiceSymbolName: 1.25T-4P-WT
CN7 = 1.25T-6P-WT: BOM_Manufacturer: HRO; BOM_Supplier: LCSC; BOM_Manufacturer Part: 1.25T-6P-WT; BOM_Supplier Part: C97377; spicePre: C; spiceSymbolName: 1.25T-6P-WT
D5 = 1N4007W: as D1 on sheet DRIVERv1.4; BOM_Supplier: LCSC; BOM_Supplier Part: C328592; BOM_Manufacturer Part: 1N4007W; spicePre: D; spiceSymbolName: 1N4007W
FPC1 = F0502-B-18-20T-R: BOM_Manufacturer: XFCN; Contributor: LCSC; BOM_Supplier: LCSC; BOM_Supplier Part: C512918; BOM_Manufacturer Part: F0502-B-18-20T-R; spicePre: F; spiceSymbolName: F0502-B-18-20T-R
FPC2 = F0502-B-24-20T-R: BOM_Manufacturer: XFCN; Contributor: LCSC; BOM_Supplier: LCSC; BOM_Supplier Part: C512919; BOM_Manufacturer Part: F0502-B-24-20T-R; spicePre: F; spiceSymbolName: F0502-B-24-20T-R
KEY2 = K2-3.6×6.1_SMD: as KEY1 on sheet COREv1.4; BOM_Supplier Part: C118141; BOM_Supplier: LCSC; spicePre: K; spiceSymbolName: K2-3.6×6.1_SMD
LED3 = LED-0603_G: as LED2 on sheet DCv1.4; BOM_Supplier Part: C72043; BOM_Supplier: LCSC; spicePre: L; spiceSymbolName: LED-0603_G
LED4 = LED-0603_R: as LED1 on sheet DCv1.4; BOM_Supplier Part: C72044; BOM_Supplier: LCSC; spicePre: L; spiceSymbolName: LED-0603_R
P4 = SMT-2.54-2X4P: Contributor: before_light; BOM_Supplier: null; BOM_Supplier Part: 2x4P; spicePre: P; spiceSymbolName: SMT-2.54-2X4P
R42-R49 R50#2 = R0603: as R1 on sheet DCv1.4; spicePre: R; spiceSymbolName: R_0603_EU
SW2 = 五向-大: BOM_Manufacturer: HRO; Contributor: LCSC; BOM_Supplier: LCSC; BOM_Manufacturer Part: K1-1504SA-03; BOM_Supplier Part: C145913; spicePre: S; spiceSymbolName: K1-1504SA-03
SW3 = switch: BOM_Manufacturer: TE Connectivity; Contributor: LCSC; BOM_Supplier: LCSC; BOM_Supplier Part: C266185; BOM_Manufacturer Part: 1-1825059-8; spicePre: S; spiceSymbolName: 1-1825059-8
U10 = K24C02_C10510: BOM_Manufacturer: Hua Hong NEC; BOM_Manufacturer Part: K24C02; BOM_Supplier: LCSC; image: //image.lceda.cn/szlcsc/C10510.jpg; BOM_Supplier Part: C10510; spicePre: U; spiceSymbolName: K24C02_C10510
U11 = 74HC4051PW,118: BOM_Manufacturer: Nexperia; SMT Type: Extend; BOM_Supplier: LCSC; BOM_Manufacturer Part: 74HC4051PW,118; image: //image.lceda.cn/szlcsc/C5645.jpg; BOM_Supplier Part: C5645; BOM_LCSC Assembly: Yes; spicePre: U; spiceSymbolName: 74HC4051PW,118

## Sheet ANALOGv1.4.SchDoc
size A4
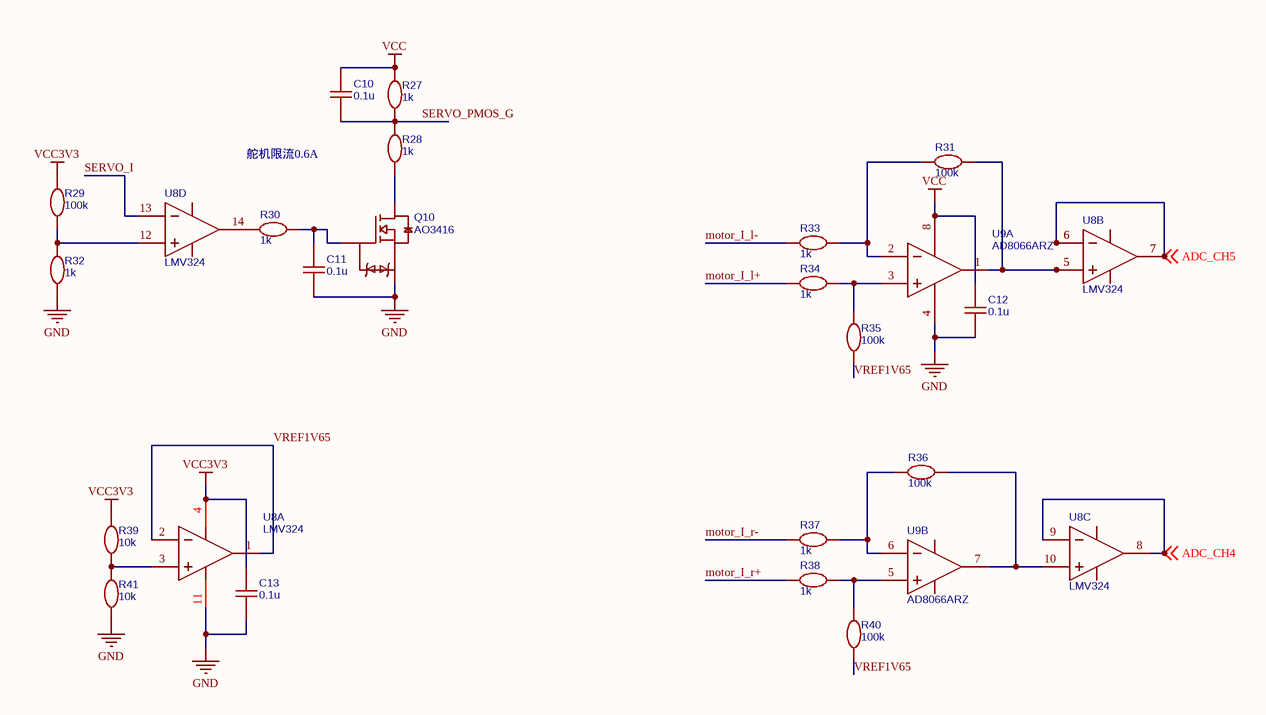
[diagram p4: ANALOGv1.4.SchDoc]

### Parts
C10  0.1u  [C0603]
C11  0.1u  [C0603]
C12  0.1u  [C0603]
C13  0.1u  [C0603]
Q10  AO3416  [SOT-23-3_L2.9-W1.6-P1.90-LS2.8-BR]
R27  1k  [R0603]
R28  1k  [R0603]
R29  100k  [R0603]
R30  1k  [R0603]
R31  100k  [R0603]
R32  1k  [R0603]
R33  1k  [R0603]
R34  1k  [R0603]
R35  100k  [R0603]
R36  100k  [R0603]
R37  1k  [R0603]
R38  1k  [R0603]
R39  10k  [R0603]
R40  100k  [R0603]
R41  10k  [R0603]
U8  LMV324  [SOP-14_L8.6-W3.9-P1.27-LS6.0-BL]  (parts A,B,C,D of 4)
U9  AD8066ARZ  [SOIC-8_L5.0-W4.0-P1.27-LS6.0-BL]  (parts A,B of 2)

### Nets
GND: C11.1 C12.1 C13.1 Q10.2(S) R32.1 R41.1 U8.11(GND) U9.4(-VS)
VCC: C10.2 C12.2 R27.2 U9.8(+VS)
VCC3V3: C13.2 R29.2 R39.2 U8.4(VCC)
ADC_CH4: U8.8(3OUT) U8.9(3IN-) ; off-sheet ADC_CH4  [project net L10_CAN2_RX]
ADC_CH5: U8.6(2IN-) U8.7(2OUT) ; off-sheet ADC_CH5  [project net J11_I2C1_SCL]
motor_I_l+: R34.1
motor_I_l-: R33.1
motor_I_r+: R38.1
motor_I_r-: R37.1
SERVO_I: U8.13(4IN-)
SERVO_PMOS_G: C10.1 R27.1 R28.2
VREF1V65: R35.1 R40.1 U8.1(1OUT) U8.2(1IN-)
NetC11_2: C11.2 Q10.1(G) R30.2
NetQ10_3: Q10.3(D) R28.1
NetR29_1: R29.1 R32.2 U8.12(4IN+)
NetR30_1: R30.1 U8.14(4OUT)
NetR31_1: R31.1 R33.2 U9.2(-IN_1)
NetR31_2: R31.2 U8.5(2IN+) U9.1(VOUT_1)
NetR34_2: R34.2 R35.2 U9.3(+IN_1)
NetR36_1: R36.1 U8.10(3IN+) U9.7(VOUT_2)
NetR36_2: R36.2 R37.2 U9.6(-IN_2)
NetR38_2: R38.2 R40.2 U9.5(+IN_2)
NetR39_1: R39.1 R41.2 U8.3(1IN+)

### Notes on the sheet
- 舵机限流0.6A

### Library data of the parts
C10-C13 = C0603: as C1 on sheet DCv1.4; spicePre: C; spiceSymbolName: C_0603_US
Q10 = AO3416: BOM_Manufacturer: AOS; SMT Type: Extend; BOM_Supplier: LCSC; BOM_Manufacturer Part: AO3416; BOM_Supplier Part: C43307; BOM_LCSC Assembly: Yes; spicePre: Q; spiceSymbolName: AO3416
R27-R41 = R0603: as R1 on sheet DCv1.4; spicePre: R; spiceSymbolName: R_0603_EU
U8 = LMV324: BOM_Manufacturer: IDCHIP; subpart_no: 1; BOM_Supplier: LCSC; BOM_Supplier Part: C395458; BOM_Manufacturer Part: LMV324; spicePre: U; spiceSymbolName: LMV324
U9 = AD8066ARZ: BOM_Manufacturer: ADI; subpart_no: 1; tags: FET Operational Amplifier; BOM_Supplier Part: C9647; BOM_Supplier: LCSC; BOM_Manufacturer Part: AD8066ARZ; image: http://image.lceda.cn/szlcsc/C9647.jpg; spicePre: U; spiceSymbolName: AD8066ARZ

## Sheet CAMERAv1.4.SchDoc
size A4
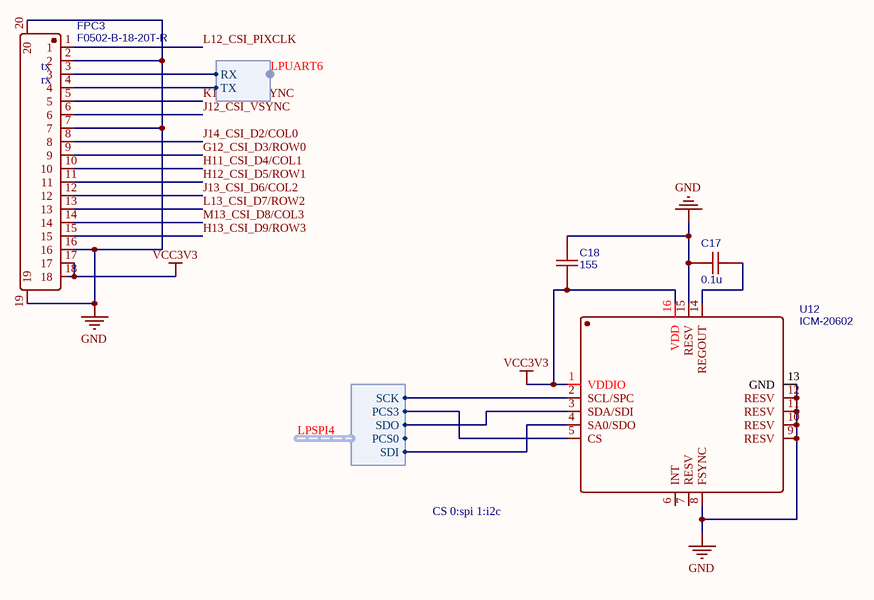
[diagram p5: CAMERAv1.4.SchDoc]

### Parts
C17  0.1u  [C0603]
C18  155  [C0603]
FPC3  F0502-B-18-20T-R  [FPC-SMD_18P-P0.50_F0502-B-18-20T-R]
U12  ICM-20602  [LGA-16_L3.0-W3.0-P0.50-BL]

### Harnesses
uart: TX, RX
SPI: SDI, SDO, SCK, PCS0, PCS3

### Nets
GND: C17.1 C18.2 FPC3.2 FPC3.7 FPC3.16 FPC3.19 FPC3.20 U12.8(FSYNC) U12.9(RESV) U12.10(RESV) U12.11(RESV) U12.12(RESV) U12.13(GND) U12.15(RESV)
VCC3V3: C18.1 FPC3.17 FPC3.18 U12.1(VDDIO) U12.16(VDD)
B12_ENET_TX_D0: U12.2(SCL/SPC) ; harness SPI.SCK
C12_ENET_CRS: U12.3(SDA/SDI) ; harness SPI.SDO
C13_ENET_RX_ER: U12.5(CS) ; harness SPI.PCS3
D12_ENET_RX_D1: U12.4(SA0/SDO) ; harness SPI.SDI
G11_ENET_nRST: FPC3.3 ; harness uart.RX
G12_CSI_D3/ROW0: FPC3.9
H11_CSI_D4/COL1: FPC3.10
H12_CSI_D5/ROW1: FPC3.11
H13_CSI_D9/ROW3: FPC3.15
J12_CSI_VSYNC: FPC3.6
J13_CSI_D6/COL2: FPC3.12
J14_CSI_D2/COL0: FPC3.8
K10_CSI_HSYNC: FPC3.5
L12_CSI_PIXCLK: FPC3.1
L13_CSI_D7/ROW2: FPC3.13
LPUART6.TX: FPC3.4 ; harness uart.TX
M13_CSI_D8/COL3: FPC3.14
NetC17_2: C17.2 U12.14(REGOUT)

Not connected (* = marked no-connect by the designer): U12 6(INT) 7(RESV)

### Notes on the sheet
- (near FPC3) tx
- (near FPC3) rx
- CS 0:spi 1:i2c

### Library data of the parts
C17 C18 = C0603: as C1 on sheet DCv1.4; spicePre: C; spiceSymbolName: C_0603_US
FPC3 = F0502-B-18-20T-R: as FPC1 on sheet CONNECTv1.4; BOM_Supplier: LCSC; BOM_Supplier Part: C512918; BOM_Manufacturer Part: F0502-B-18-20T-R; spicePre: F; spiceSymbolName: F0502-B-18-20T-R
U12 = ICM-20602: BOM_Manufacturer: TDK InvenSense; Contributor: LCSC; SMT Type: Extend; BOM_Supplier: LCSC; BOM_Supplier Part: C97633; BOM_Manufacturer Part: ICM-20602; BOM_LCSC Assembly: Yes; spicePre: U; spiceSymbolName: ICM-20602

## Nets that join several sheets
GND: COREv1.4 (20 pins), DCv1.4 (13 pins), DRIVERv1.4 (15 pins), CONNECTv1.4 (52 pins), ANALOGv1.4 (8 pins), CAMERAv1.4 (14 pins)
V_CORE5V: COREv1.4 (P1.78 P1.80), DCv1.4 (7 pins), CONNECTv1.4 (D5.1)
VCC: DCv1.4 (5 pins), DRIVERv1.4 (13 pins), CONNECTv1.4 (R44.2), ANALOGv1.4 (C10.2 C12.2 R27.2 U9.8)
VCC3V3: DCv1.4 (6 pins), DRIVERv1.4 (7 pins), CONNECTv1.4 (26 pins), ANALOGv1.4 (C13.2 R29.2 R39.2 U8.4), CAMERAv1.4 (5 pins)
A8_LCDIF_DATA02: COREv1.4 (P2.34), CONNECTv1.4 (FPC2.6)
A9_LCDIF_DATA03: COREv1.4 (P2.36), CONNECTv1.4 (FPC2.5)
A10_LCDIF_DATA07/BT_CFG_7: COREv1.4 (P2.44), DRIVERv1.4 (U7.2)
A11_LCDIF_DATA12: COREv1.4 (P2.56), CONNECTv1.4 (CN9.4)
A12_ENET_TX_D1: COREv1.4 (P2.31), CONNECTv1.4 (BUZZER1.2 C16.1)
A13_ENET_TX_EN: COREv1.4 (P2.35), CONNECTv1.4 (SW3.3)
B8_LCDIF_DATA01: COREv1.4 (P2.32), CONNECTv1.4 (FPC2.7 KEY2.2)
B9_LCDIF_DATA04: COREv1.4 (P2.38), DRIVERv1.4 (U3.2)
B11_LCDIF_DATA13: COREv1.4 (P2.58), CONNECTv1.4 (CN9.3)
B12_ENET_TX_D0: COREv1.4 (P2.33), CONNECTv1.4 (CN7.3), CAMERAv1.4 (U12.2)
B13_ENET_TX_CLK: COREv1.4 (P2.45), CONNECTv1.4 (SW3.4)
B14_LCD_PWM: COREv1.4 (P2.49), DRIVERv1.4 (CN6.4 R24.2)
C8_LCDIF_DATA00: COREv1.4 (P2.30), CONNECTv1.4 (FPC2.8 SW2.6)
C9_LCDIF_DATA05: COREv1.4 (P2.40), DRIVERv1.4 (U5.2)
C10_LCDIF_DATA08: COREv1.4 (P2.48), CONNECTv1.4 (FPC2.15)
C11_LCDIF_DATA14: COREv1.4 (P2.60), DRIVERv1.4 (CN5.3 R20.2)
C12_ENET_CRS: COREv1.4 (P2.39), CONNECTv1.4 (CN7.4), CAMERAv1.4 (U12.3)
C13_ENET_RX_ER: COREv1.4 (P2.37), CAMERAv1.4 (U12.5)
C14_LCD_TPINT: COREv1.4 (P2.51), DRIVERv1.4 (CN6.3 R23.2)
D7_LCDIF_CLK: COREv1.4 (P2.72), CONNECTv1.4 (FPC2.9 SW2.5)
D8_LCDIF_VSYNC: COREv1.4 (P2.68), CONNECTv1.4 (FPC2.11 SW2.3 U11.10)
D9_LCDIF_DATA06/BT_CFG_6: COREv1.4 (P2.42), DRIVERv1.4 (U6.2)
D10_LCDIF_DATA09: COREv1.4 (P2.50), CONNECTv1.4 (FPC2.16)
D11_LCDIF_DATA15: COREv1.4 (P2.62), DRIVERv1.4 (CN5.4 R21.2)
D12_ENET_RX_D1: COREv1.4 (P2.43), CONNECTv1.4 (CN7.5), CAMERAv1.4 (U12.4)
D13_SD1_CD: COREv1.4 (P2.53), CONNECTv1.4 (CN1.4)
D14_WDOG1_B: COREv1.4 (P2.55), CONNECTv1.4 (CN1.3)
E7_LCDIF_ENABLE: COREv1.4 (P2.70), CONNECTv1.4 (FPC2.10 SW2.4 U11.9)
E8_LCDIF_HSYNC: COREv1.4 (P2.66), CONNECTv1.4 (FPC2.12 SW2.2 U11.11)
E10_LCDIF_DATA10: COREv1.4 (P2.52), DRIVERv1.4 (R50#1.2 U4.1)
E11_LCDIF_DATA11: COREv1.4 (P2.54), DRIVERv1.4 (5 pins)
E12_ENET_RX_D0: COREv1.4 (P2.41), CONNECTv1.4 (CN7.6)
E14_JTAG_TMS/SWD_DIO: COREv1.4 (P2.63), CONNECTv1.4 (P4.4)
F11_BOOT_MODE0: COREv1.4 (P2.73), CONNECTv1.4 (SW3.1)
F12_JTAG_TCK/SWD_CLK: COREv1.4 (P2.65), CONNECTv1.4 (P4.3)
G10_JTAG_nTRST: COREv1.4 (P2.59), CONNECTv1.4 (P4.5)
G11_ENET_nRST: COREv1.4 (P2.77), CAMERAv1.4 (FPC3.3)
G12_CSI_D3/ROW0: COREv1.4 (P1.57), CAMERAv1.4 (FPC3.9)
G14_BOOT_MODE1: COREv1.4 (P2.75), CONNECTv1.4 (KEY2.1 SW2.1 SW3.2)
H2_SD1_D2: COREv1.4 (P1.11), CONNECTv1.4 (CARD1.1)
H11_CSI_D4/COL1: COREv1.4 (P1.55), CAMERAv1.4 (FPC3.10)
H12_CSI_D5/ROW1: COREv1.4 (P1.59), CAMERAv1.4 (FPC3.11)
H13_CSI_D9/ROW3: COREv1.4 (P1.73), CAMERAv1.4 (FPC3.15)
H14_CAN2_TX/ADC: COREv1.4 (P1.58), CONNECTv1.4 (U11.3)
J1_SD1_D0/SPI1_D0: COREv1.4 (P1.3), CONNECTv1.4 (CARD1.7)
J2_SD1_D3: COREv1.4 (P1.9), CONNECTv1.4 (CARD1.2)
J3_SD1_CLK0/SPI1_CS0: COREv1.4 (P1.5), CONNECTv1.4 (CARD1.5)
J4_SD1_CMD/SPI1_SCLK: COREv1.4 (P1.7), CONNECTv1.4 (CARD1.3)
J11_I2C1_SCL: COREv1.4 (P1.68), ANALOGv1.4 (U8.6 U8.7)
J12_CSI_VSYNC: COREv1.4 (P1.77), CAMERAv1.4 (FPC3.6)
J13_CSI_D6/COL2: COREv1.4 (P1.63), CAMERAv1.4 (FPC3.12)
J14_CSI_D2/COL0: COREv1.4 (P1.61), CAMERAv1.4 (FPC3.8)
K1_SD1_D1/SPI1_D1: COREv1.4 (P1.1), CONNECTv1.4 (CARD1.8)
K7_ON_REQ: COREv1.4 (P1.48), DCv1.4 (R7.2 R8.1 U2.8)
K10_CSI_HSYNC: COREv1.4 (P1.75), CAMERAv1.4 (FPC3.5)
K14_UART1_TXD: COREv1.4 (P2.78), CONNECTv1.4 (P4.8)
L6_WAKEUP: COREv1.4 (P1.40), CONNECTv1.4 (R46.2)
L7_PERI_PWREN: COREv1.4 (P1.44), CONNECTv1.4 (R48.2)
L10_CAN2_RX: COREv1.4 (P1.56), ANALOGv1.4 (U8.8 U8.9)
L12_CSI_PIXCLK: COREv1.4 (P1.65), CAMERAv1.4 (FPC3.1)
L13_CSI_D7/ROW2: COREv1.4 (P1.67), CAMERAv1.4 (FPC3.13)
L14_UART1_RXD: COREv1.4 (P2.80), CONNECTv1.4 (P4.1)
LPI2C1.SCL: COREv1.4 (P1.15), CONNECTv1.4 (CN8.3 CN10.3 R42.1 U10.6)
LPI2C1.SDA: COREv1.4 (P1.17), CONNECTv1.4 (CN8.4 CN10.4 R43.1 U10.5)
LPUART6.TX: COREv1.4 (P2.79), CAMERAv1.4 (FPC3.4)
M3_FlexSPI_D1_B: COREv1.4 (P1.19), DRIVERv1.4 (U4.2)
M13_CSI_D8/COL3: COREv1.4 (P1.69), CAMERAv1.4 (FPC3.14)
motor_I_l+: DRIVERv1.4 (CN3.2 R14.2), ANALOGv1.4 (R34.1)
motor_I_l-: DRIVERv1.4 (5 pins), ANALOGv1.4 (R33.1)
motor_I_r+: DRIVERv1.4 (CN4.2 R22.2), ANALOGv1.4 (R38.1)
motor_I_r-: DRIVERv1.4 (5 pins), ANALOGv1.4 (R37.1)
SERVO_I: DRIVERv1.4 (P3.3 R13.2), ANALOGv1.4 (U8.13)
SERVO_PMOS_G: DRIVERv1.4 (Q2.1), ANALOGv1.4 (C10.1 R27.1 R28.2)